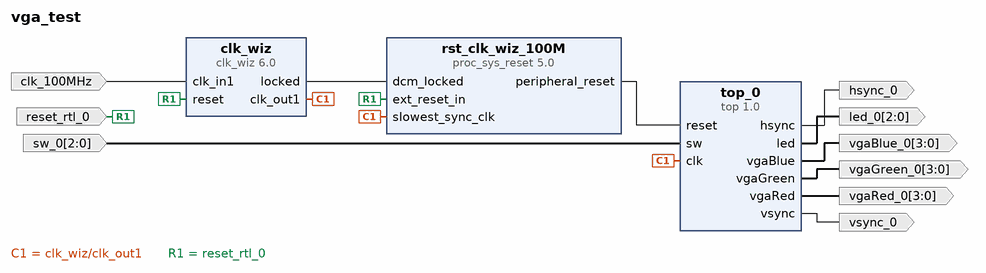
[diagram p0: block diagram of the top level]
# Vivado block design vga_test, xc7a35tcpg236-1, Vivado 2023.2
create_bd_design vga_test

create_bd_port -dir I -type clk clk_100MHz
set_property -dict {CONFIG.FREQ_HZ 100000000} [get_bd_ports clk_100MHz]
create_bd_port -dir I -type rst reset_rtl_0
set_property -dict {CONFIG.POLARITY ACTIVE_HIGH} [get_bd_ports reset_rtl_0]
create_bd_port -dir O hsync_0
create_bd_port -dir O -from 2 -to 0 led_0
create_bd_port -dir I -from 2 -to 0 sw_0
create_bd_port -dir O -from 3 -to 0 vgaBlue_0
create_bd_port -dir O -from 3 -to 0 vgaGreen_0
create_bd_port -dir O -from 3 -to 0 vgaRed_0
create_bd_port -dir O vsync_0

create_bd_cell -type ip -vlnv xilinx.com:user:top:1.0 top_0
create_bd_cell -type ip -vlnv xilinx.com:ip:clk_wiz:6.0 clk_wiz
create_bd_cell -type ip -vlnv xilinx.com:ip:proc_sys_reset:5.0 rst_clk_wiz_100M

# ---- connections ----

connect_bd_net [get_bd_ports clk_100MHz] [get_bd_pins clk_wiz/clk_in1]
connect_bd_net [get_bd_pins clk_wiz/clk_out1] [get_bd_pins top_0/clk] [get_bd_pins rst_clk_wiz_100M/slowest_sync_clk]
connect_bd_net [get_bd_pins clk_wiz/locked] [get_bd_pins rst_clk_wiz_100M/dcm_locked]
connect_bd_net -net reset_rtl_0_1 [get_bd_ports reset_rtl_0] [get_bd_pins clk_wiz/reset] [get_bd_pins rst_clk_wiz_100M/ext_reset_in]
connect_bd_net [get_bd_pins rst_clk_wiz_100M/peripheral_reset] [get_bd_pins top_0/reset]
connect_bd_net -net sw_0_1 [get_bd_ports sw_0] [get_bd_pins top_0/sw]
connect_bd_net [get_bd_pins top_0/hsync] [get_bd_ports hsync_0]
connect_bd_net [get_bd_pins top_0/led] [get_bd_ports led_0]
connect_bd_net [get_bd_pins top_0/vgaBlue] [get_bd_ports vgaBlue_0]
connect_bd_net [get_bd_pins top_0/vgaGreen] [get_bd_ports vgaGreen_0]
connect_bd_net [get_bd_pins top_0/vgaRed] [get_bd_ports vgaRed_0]
connect_bd_net [get_bd_pins top_0/vsync] [get_bd_ports vsync_0]

validate_bd_design
save_bd_design
